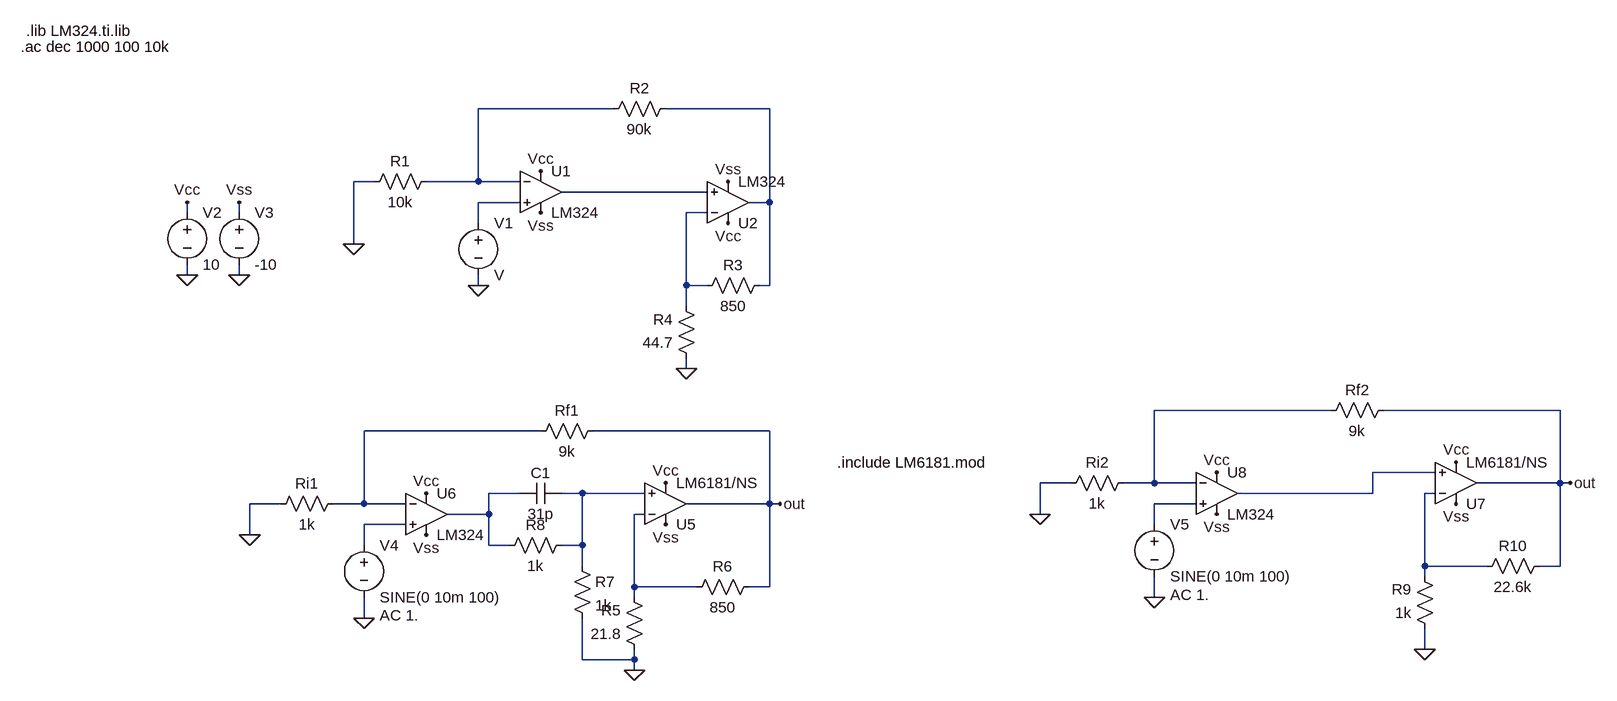
[diagram p0: schematic TP3_MORALES_SUAREZ_TORRES.asc]
TP3_MORALES_SUAREZ_TORRES.asc, the LTspice schematic file:
Version 4.1
SHEET 1 3544 1204
WIRE 2016 192 1808 192
WIRE 2256 192 2096 192
WIRE 1648 304 1616 304
WIRE 1808 304 1808 192
WIRE 1808 304 1728 304
WIRE 1872 304 1808 304
WIRE 2160 320 1936 320
WIRE 1872 336 1808 336
WIRE 2256 336 2256 192
WIRE 2256 336 2224 336
WIRE 1360 352 1360 336
WIRE 1440 352 1440 336
WIRE 2160 352 2128 352
WIRE 1808 368 1808 336
WIRE 1616 400 1616 304
WIRE 1360 448 1360 432
WIRE 1440 448 1440 432
WIRE 1808 464 1808 448
WIRE 2128 464 2128 352
WIRE 2160 464 2128 464
WIRE 2256 464 2256 336
WIRE 2256 464 2240 464
WIRE 2128 496 2128 464
WIRE 2128 592 2128 576
WIRE 3120 656 2848 656
WIRE 3472 656 3200 656
WIRE 1904 688 1632 688
WIRE 2256 688 1984 688
WIRE 3280 752 3184 752
WIRE 2720 768 2672 768
WIRE 2848 768 2848 656
WIRE 2848 768 2800 768
WIRE 2912 768 2848 768
WIRE 3472 768 3472 656
WIRE 3472 768 3344 768
WIRE 3488 768 3472 768
WIRE 1872 784 1824 784
WIRE 1968 784 1936 784
WIRE 2064 784 1968 784
WIRE 3184 784 3184 752
WIRE 3184 784 2976 784
WIRE 3280 784 3264 784
WIRE 1504 800 1456 800
WIRE 1632 800 1632 688
WIRE 1632 800 1584 800
WIRE 1696 800 1632 800
WIRE 2256 800 2256 688
WIRE 2256 800 2128 800
WIRE 2272 800 2256 800
WIRE 2912 800 2848 800
WIRE 1824 816 1824 784
WIRE 1824 816 1760 816
WIRE 2064 816 2048 816
WIRE 2672 816 2672 768
WIRE 1696 832 1632 832
WIRE 2848 832 2848 800
WIRE 1456 848 1456 800
WIRE 1632 864 1632 832
WIRE 1824 864 1824 816
WIRE 1856 864 1824 864
WIRE 1968 864 1968 784
WIRE 1968 864 1936 864
WIRE 1968 896 1968 864
WIRE 3264 896 3264 784
WIRE 3360 896 3264 896
WIRE 3472 896 3472 768
WIRE 3472 896 3440 896
WIRE 3264 912 3264 896
WIRE 2048 928 2048 816
WIRE 2144 928 2048 928
WIRE 2256 928 2256 800
WIRE 2256 928 2224 928
WIRE 2048 944 2048 928
WIRE 2848 944 2848 912
WIRE 1632 976 1632 944
WIRE 3264 1024 3264 992
WIRE 1968 1040 1968 976
WIRE 2048 1040 2048 1024
WIRE 2048 1040 1968 1040
WIRE 2048 1056 2048 1040
FLAG 1904 352 Vss
FLAG 1904 288 Vcc
FLAG 1616 400 0
FLAG 1808 464 0
FLAG 2192 304 Vss
FLAG 2192 368 Vcc
FLAG 2128 592 0
FLAG 1360 448 0
FLAG 1440 448 0
FLAG 1360 336 Vcc
FLAG 1440 336 Vss
FLAG 2048 1056 0
FLAG 1456 848 0
FLAG 1632 976 0
FLAG 2272 800 out
FLAG 1728 784 Vcc
FLAG 1728 848 Vss
FLAG 2096 768 Vcc
FLAG 2096 832 Vss
FLAG 3264 1024 0
FLAG 2672 816 0
FLAG 2848 944 0
FLAG 3488 768 out
FLAG 2944 752 Vcc
FLAG 2944 816 Vss
FLAG 3312 736 Vcc
FLAG 3312 800 Vss
SYMBOL OpAmps\\opamp2 1904 256 R0
SYMATTR InstName U1
SYMATTR Value LM324
SYMBOL res 1744 288 R90
WINDOW 0 0 56 VBottom 2
WINDOW 3 32 56 VTop 2
SYMATTR InstName R1
SYMATTR Value 10k
SYMBOL res 2112 176 R90
WINDOW 0 0 56 VBottom 2
WINDOW 3 32 56 VTop 2
SYMATTR InstName R2
SYMATTR Value 90k
SYMBOL res 2256 448 R90
WINDOW 0 0 56 VBottom 2
WINDOW 3 32 56 VTop 2
SYMATTR InstName R3
SYMATTR Value 850
SYMBOL res 2144 592 R180
WINDOW 0 36 76 Left 2
WINDOW 3 36 40 Left 2
SYMATTR InstName R4
SYMATTR Value 44.7
SYMBOL voltage 1808 352 R0
SYMATTR InstName V1
SYMBOL OpAmps\\opamp2 2192 400 M180
SYMATTR InstName U2
SYMATTR Value LM324
SYMBOL voltage 1360 336 R0
SYMATTR InstName V2
SYMATTR Value 10
SYMBOL voltage 1440 336 R0
SYMATTR InstName V3
SYMATTR Value -10
SYMBOL res 1600 784 R90
WINDOW 0 0 56 VBottom 2
WINDOW 3 32 56 VTop 2
SYMATTR InstName Ri1
SYMATTR Value 1k
SYMBOL res 2000 672 R90
WINDOW 0 0 56 VBottom 2
WINDOW 3 32 56 VTop 2
SYMATTR InstName Rf1
SYMATTR Value 9k
SYMBOL res 2064 1040 R180
WINDOW 0 36 76 Left 2
WINDOW 3 36 40 Left 2
SYMATTR InstName R5
SYMATTR Value 21.8
SYMBOL res 2128 944 R270
WINDOW 0 32 56 VTop 2
WINDOW 3 0 56 VBottom 2
SYMATTR InstName R6
SYMATTR Value 850
SYMBOL voltage 1632 848 R0
WINDOW 123 24 124 Left 2
WINDOW 39 0 0 Left 0
SYMATTR Value2 AC 1.
SYMATTR InstName V4
SYMATTR Value SINE(0 10m 100)
SYMBOL res 1952 880 R0
SYMATTR InstName R7
SYMATTR Value 1k
SYMBOL cap 1936 768 R90
WINDOW 0 0 32 VBottom 2
WINDOW 3 32 32 VTop 2
SYMATTR InstName C1
SYMATTR Value 31p
SYMBOL res 1952 848 R90
WINDOW 0 0 56 VBottom 2
WINDOW 3 32 56 VTop 2
SYMATTR InstName R8
SYMATTR Value 1k
SYMBOL OpAmps\\opamp2 2096 864 M180
SYMATTR InstName U5
SYMATTR Value LM6181/NS
SYMBOL OpAmps\\opamp2 1728 752 R0
SYMATTR InstName U6
SYMATTR Value LM324
SYMBOL res 2816 752 R90
WINDOW 0 0 56 VBottom 2
WINDOW 3 32 56 VTop 2
SYMATTR InstName Ri2
SYMATTR Value 1k
SYMBOL res 3216 640 R90
WINDOW 0 0 56 VBottom 2
WINDOW 3 32 56 VTop 2
SYMATTR InstName Rf2
SYMATTR Value 9k
SYMBOL res 3280 1008 R180
WINDOW 0 36 76 Left 2
WINDOW 3 36 40 Left 2
SYMATTR InstName R9
SYMATTR Value 1k
SYMBOL res 3344 912 R270
WINDOW 0 32 56 VTop 2
WINDOW 3 0 56 VBottom 2
SYMATTR InstName R10
SYMATTR Value 22.6k
SYMBOL voltage 2848 816 R0
WINDOW 123 24 124 Left 2
WINDOW 39 0 0 Left 0
SYMATTR Value2 AC 1.
SYMATTR InstName V5
SYMATTR Value SINE(0 10m 100)
SYMBOL OpAmps\\opamp2 3312 832 M180
SYMATTR InstName U7
SYMATTR Value LM6181/NS
SYMBOL OpAmps\\opamp2 2944 720 R0
SYMATTR InstName U8
SYMATTR Value LM324
TEXT 1112 72 Left 2 !.lib LM324.ti.lib
TEXT 1104 96 Left 2 !.ac dec 1000 100 10k
TEXT 2360 736 Left 2 !.include LM6181.mod

The netlist it stands for:
* TP3_MORALES_SUAREZ_TORRES.asc
X§U1 N004 N001 Vcc Vss N003 LM324  ; pins In+ In- V+ V- OUT
R1 N001 0 10k
R2 N002 N001 90k
R3 N002 N005 850
R4 0 N005 44.7
V1 N004 0 V
X§U2 N003 N005 Vcc Vss N002 LM324  ; pins In+ In- V+ V- OUT
V2 Vcc 0 10
V3 Vss 0 -10
Ri1 N007 0 1k
Rf1 out N007 9k
R5 0 N013 21.8
R6 N013 out 850
V4 N014 0 SINE(0 10m 100) AC 1.
R7 N010 0 1k
C1 N010 N009 31p
R8 N010 N009 1k
X§U5 N010 N013 Vss Vcc out LM6181/NS  ; pins In+ In- V+ V- OUT
X§U6 N014 N007 Vcc Vss N009 LM324  ; pins In+ In- V+ V- OUT
Ri2 N006 0 1k
Rf2 out N006 9k
R9 0 N011 1k
R10 N011 out 22.6k
V5 N012 0 SINE(0 10m 100) AC 1.
X§U7 N008 N011 Vss Vcc out LM6181/NS  ; pins In+ In- V+ V- OUT
X§U8 N012 N006 Vcc Vss N008 LM324  ; pins In+ In- V+ V- OUT
.lib LM324.ti.lib
.ac dec 1000 100 10k
.include LM6181.mod
.backanno
.end